# Altium project GPS track2.PrjPCB
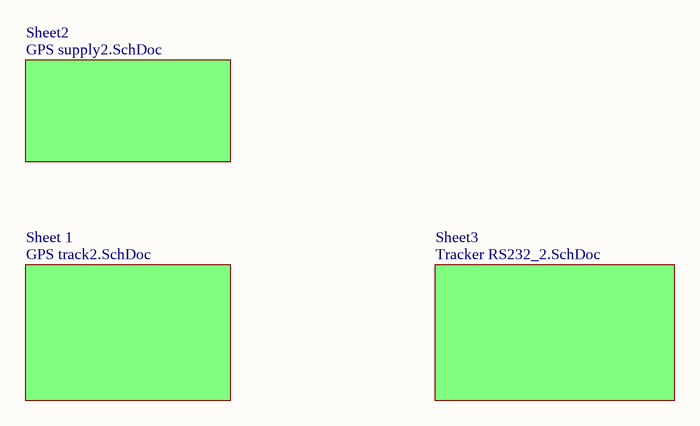
[diagram p0: Master track2.SchDoc]
4 sheets, 197 parts. Net scope: global (net labels, ports and power ports of the same name join across sheets).
Board file: GPS track2.PcbDoc
Sheets:
  Master track2.SchDoc
    Sheet2 = GPS supply2.SchDoc
    Sheet 1 = GPS track2.SchDoc
    Sheet3 = Tracker RS232_2.SchDoc

## Sheet Master track2.SchDoc: GPS tracker with AX.25 radio modem
size A4; Author: I.Ivanov; CompanyName: TU-Sofia; DrawnBy: Eng. I. Ivanov; Engineer: I.Ivanov; Organization: TU-Sofia; SheetNumber: 0; SheetTotal: 3

### Sub-sheets
Sheet2 = GPS supply2.SchDoc: no entries
Sheet3 = Tracker RS232_2.SchDoc: no entries
Sheet 1 = GPS track2.SchDoc: no entries

## Sheet GPS supply2.SchDoc: GPS traker power supply managment
size A4; DrawnBy: Eng. I.Ivanov; Engineer: Eng. I.Ivanov; Revision: 2; SheetNumber: 2; SheetTotal: 3; PageSetup: Record=PageOptions|CenterHorizontal=True|CenterVertical=True|PrintScale=4.01|XCorrection=1.00|YCorrection=1.00|PrintKind=0|BorderSize=5000000|LeftOffset=0|BottomOffset=0|Orientation=2|PaperLength=1000|PaperWidth=1000|Scale=100|PaperSource=15|PrintQuality=1200|MediaType=1|DitherType=10|PaperKind=A0|PrintScaleMode=1
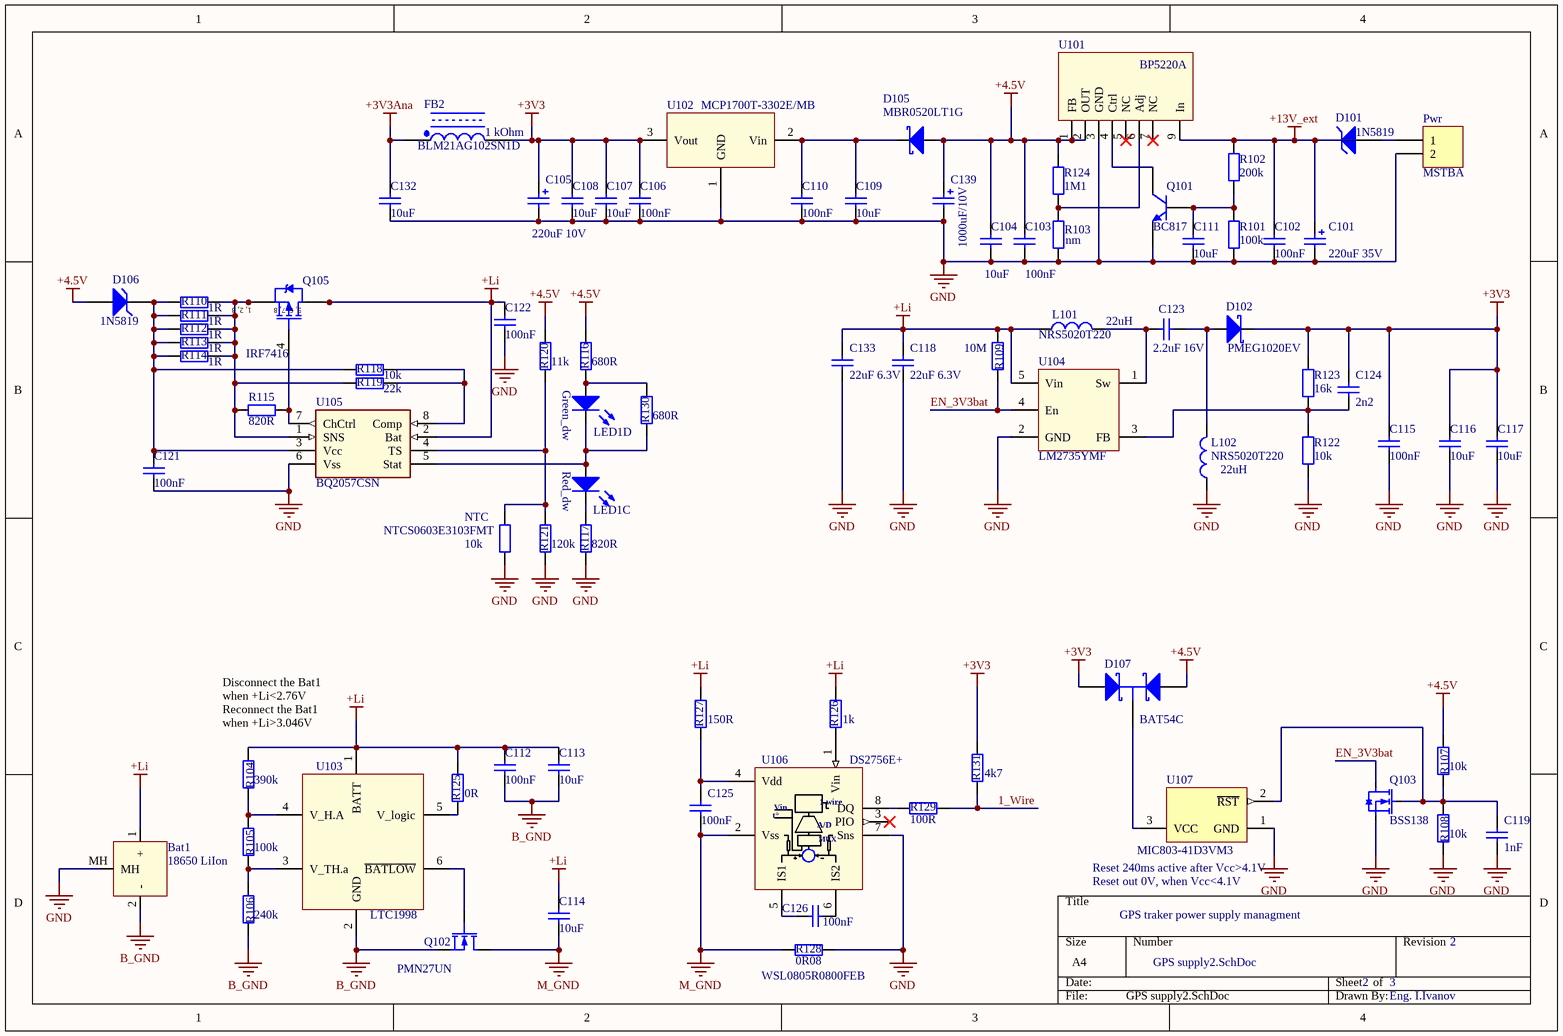
[diagram p1: GPS supply2.SchDoc]

### Parts
Bat1  value 18650 LiIon  [18650]  (hidden comment: LiIon)
C101  220uF 35V  [Cap electrolyt 7]
C102  value 100nF  [2012[0805]]  (hidden comment: Cap Semi)
C103  value 100nF  [2012[0805]]  (hidden comment: Cap Semi)
C104  value 10uF  [2012[0805]]  (hidden comment: Cap Semi)
C105  value 220uF 10V  [Cap electrolyt 8]  (hidden comment: CAP ELECTOLYT)
C106  value 100nF  [2012[0805]]  (hidden comment: Cap Semi)
C107  value 10uF  [2012[0805]]  (hidden comment: Cap Semi)
C108  value 10uF  [2012[0805]]  (hidden comment: Cap Semi)
C109  value 10uF  [2012[0805]]  (hidden comment: Cap Semi)
C110  value 100nF  [2012[0805]]  (hidden comment: Cap Semi)
C111  value 10uF  [2012[0805]]  (hidden comment: Cap Semi)
C112  value 100nF  [2012[0805]]  (hidden comment: Cap Semi)
C113  value 10uF  [2012[0805]]  (hidden comment: Cap Semi)
C114  value 10uF  [2012[0805]]  (hidden comment: Cap Semi)
C115  value 100nF  [2012[0805]]  (hidden comment: Cap Semi)
C116  value 10uF  [2012[0805]]  (hidden comment: Cap Semi)
C117  value 10uF  [2012[0805]]  (hidden comment: Cap Semi)
C118  value 22uF 6.3V  [2012[0805]]  (hidden comment: Cap Semi)
C119  value 1nF  [2012[0805]]  (hidden comment: Cap Semi)
C121  value 100nF  [2012[0805]]  (hidden comment: Cap Semi)
C122  value 100nF  [2012[0805]]  (hidden comment: Cap Semi)
C123  value 2.2uF 16V  [2012[0805]]  (hidden comment: Cap Semi)
C124  value 2n2  [2012[0805]]  (hidden comment: Cap Semi)
C125  value 100nF  [2012[0805]]  (hidden comment: Cap Semi)
C126  value 100nF  [2012[0805]]  (hidden comment: Cap Semi)
C132  value 10uF  [2012[0805]]  (hidden comment: Cap Semi)
C133  value 22uF 6.3V  [2012[0805]]  (hidden comment: Cap Semi)
C139  value 1000uF/10V  [Cap electrolyt 7]  (hidden comment: CAP ELECTOLYT)
D101  1N5819  [DO214]
D102  PMEG1020EV  [SOT-666-DIODE]
D105  MBR0520LT1G  [SOD-123]
D106  1N5819  [DO214]
D107  BAT54C  [SOT23_N]
FB2  BLM21AG102SN1D  value 1 kOhm  [RESC2012N]
L101  value NRS5020T220  Inductance: 22uH  [NRS5020Txxx]  (hidden comment: NRS5020T Taiyo-Yuden inductor)
L102  value NRS5020T220  Inductance: 22uH  [NRS5020Txxx]  (hidden comment: NRS5020T Taiyo-Yuden inductor)
LED1  4x LED's  [515-1061F_2x dual LED's]  (value not drawn)  (parts C,D of 4)
NTC  value 10k  [1608[0603]]  (hidden comment: Res2)
Pwr  MSTBA  [MSTBA2.5/2-G-5.08]
Q101  BC817  [SOT23_N]
Q102  value PMN27UN  [SOT-23-6-MOSFET]  (hidden comment: TrenchMOS™ ultra low level FET)
Q103  value BSS138  [SOT-23_my]  (hidden comment: My BSS138)
Q105  IRF7416  [SO-8_N]
R101  value 100k  [2012[0805]]  (hidden comment: Res2)
R102  value 200k  [2012[0805]]  (hidden comment: Res2)
R103  value nm  [2012[0805]]  (hidden comment: Res2)
R104  value 390k  [2012[0805]]  (hidden comment: Res2)
R105  value 100k  [2012[0805]]  (hidden comment: Res2)
R106  value 240k  [2012[0805]]  (hidden comment: Res2)
R107  value 10k  [2012[0805]]  (hidden comment: Res2)
R108  value 10k  [2012[0805]]  (hidden comment: Res2)
R109  value 10M  [2012[0805]]  (hidden comment: Res2)
R110  value 1R  [2012[0805]]  (hidden comment: Res2)
R111  value 1R  [2012[0805]]  (hidden comment: Res2)
R112  value 1R  [2012[0805]]  (hidden comment: Res2)
R113  value 1R  [2012[0805]]  (hidden comment: Res2)
R114  value 1R  [2012[0805]]  (hidden comment: Res2)
R115  value 820R  [2012[0805]]  (hidden comment: Res2)
R116  value 680R  [2012[0805]]  (hidden comment: Res2)
R117  value 820R  [2012[0805]]  (hidden comment: Res2)
R118  value 10k  [2012[0805]]  (hidden comment: Res2)
R119  value 22k  [2012[0805]]  (hidden comment: Res2)
R120  value 11k  [2012[0805]]  (hidden comment: Res2)
R121  value 120k  [2012[0805]]  (hidden comment: Res2)
R122  value 10k  [2012[0805]]  (hidden comment: Res2)
R123  value 16k  [2012[0805]]  (hidden comment: Res2)
R124  value 1M1  [2012[0805]]  (hidden comment: Res2)
R125  value 0R  [2012[0805]]  (hidden comment: Res2)
R126  value 1k  [2012[0805]]  (hidden comment: Res2)
R127  value 150R  [2012[0805]]  (hidden comment: Res2)
R128  WSL0805R0800FEB  value 0R08  [2012[0805]]
R129  value 100R  [2012[0805]]  (hidden comment: Res2)
R130  value 680R  [2012[0805]]  (hidden comment: Res2)
R131  value 4k7  [2012[0805]]  (hidden comment: Res2)
U101  value BP5220A  [BP502xA]  (hidden comment: Rohm switching DC/DC regulator)
U102  value MCP1700T-3302E/MB  [SOT89_my]  (hidden comment: MCP1700T-xxxx)
U103  value LTC1998  [SOT26A-6N]  (hidden comment: 2.5?A, 1% Accurate  SOT-23 Comparator and Voltage  Reference for Battery Monitoring)
U104  value LM2735YMF  [SOT23-5AN]  (hidden comment: 520kHz Space-Efficient Boost and SEPIC DC-DC  Regulator)
U105  BQ2057CSN  [SO8]
U106  value DS2756E+  [TSSOP 8_My]  (hidden comment: 1 wire fuel gauge)
U107  value MIC803-41D3VM3  [MF03A_N]  (hidden comment: LM809M3-4.00)

### Nets
+3V3: C105.1 C106.2 C107.2 C108.2 C115.2 C116.2 C117.2 C124.2 D102.2(K) D107.2(A2) FB2.2 R123.1 R131.2 U102.3(Vout)
+3V3Ana: C132.2 FB2.1
+4.5V: C103.2 C104.2 C139.1 D105.1(A) D106.1(A) D107.1(A1) R107.2 R116.2 R120.1 R124.1 U101.1(FB) U101.2(OUT)
+13V_ext: C101.1 C102.2 D101.2(K) R102.2 U101.9(In)
+Li: Bat1.1(+) C112.2 C113.2 C114.2 C118.2 C122.2 C133.2 L101.1 Q105.5(D) Q105.6(D) Q105.7(D) Q105.8(D) R104.2 R109.2 R125.1 R126.1 R127.1 U103.1(BATT) U104.5(Vin) U105.2(Bat)
B_GND: Bat1.2(-) C112.1 C113.1 Q102.3(S) R106.1 U103.2(GND)
GND: Bat1.MH C101.2 C102.1 C103.1 C104.1 C105.2 C106.1 C107.1 C108.1 C109.1 C110.1 C111.1 C115.1 C116.1 C117.1 C118.1 C119.1 C121.1 C122.1 C132.1 C133.1 C139.2 L102.1 NTC.2 Pwr.2 Q101.2(E) Q103.2(S) R101.1 R103.1 R108.1 R117.1 R121.2 R122.2 R128.2 U101.3(GND) U102.1(GND) U104.2(GND) U105.6(Vss) U106.7(Sns) U107.1(GND)
M_GND: C114.1 C125.1 Q102.1(D) R128.1 U106.2(Vss)
1_Wire: R129.2 R131.1
EN_3V3bat: Q103.3(D) R109.1 U104.4(En)
NetC109_2: C109.2 C110.2 D105.2(K) U102.2(Vin)
NetC111_2: C111.2 Q101.1(B) R101.2 R102.1
NetC119_2: C119.2 Q103.1(G) R107.1 R108.2 U107.2(~{RST})
NetC121_2: C121.2 D106.2(K) R110.2 R111.2 R112.2 R113.2 R114.2 R118.2 U105.3(Vcc)
NetC123_1: C123.1 D102.1(A) L102.2
NetC123_2: C123.2 L101.2 U104.1(Sw)
NetC124_1: C124.1 R122.1 R123.2 U104.3(FB)
NetC125_2: C125.2 R127.2 U106.4(Vdd)
NetC126_1: C126.1 U106.6(IS2)
NetC126_2: C126.2 U106.5(IS1)
NetD101_1: D101.1(A) Pwr.1
NetD107_3: D107.3(K) U107.3(VCC)
NetLED1_1d: LED1.1d(K) R117.2
NetLED1_2d: LED1.2d(A) LED1.3d(K) R130.1 U105.5(Stat)
NetLED1_4d: LED1.4d(A) R116.1 R130.2
NetNTC_1: NTC.1 R120.2 R121.1 U105.4(TS)
NetQ101_3: Q101.3(C) U101.4(Ctrl)
NetQ102_2: Q102.2(G) U103.6(~{BATLOW})
NetQ105_1: Q105.1(S) Q105.2(S) Q105.3(S) R110.1 R111.1 R112.1 R113.1 R114.1 R115.1 R119.2 U105.1(SNS)
NetQ105_4: Q105.4(G) R115.2 U105.7(ChCtrl)
NetR103_2: R103.2 R124.2 U101.6(Adj)
NetR104_1: R104.1 R105.2 U103.4(V_H.A)
NetR105_1: R105.1 R106.2 U103.3(V_TH.a)
NetR118_1: R118.1 R119.1 U105.8(Comp)
NetR125_2: R125.2 U103.5(V_logic)
NetR126_2: R126.2 U106.1(Vin)
NetR129_1: R129.1 U106.8(DQ)

Not connected (* = marked no-connect by the designer): U101 5(NC)* 7(NC)*; U106 3(PIO)*

### Notes on the sheet
- (near NTC) NTCS0603E3103FMT
- Disconnect the Bat1 when +Li<2.76V
  Reconnect the Bat1 when +Li>3.046V
- (near U107) Reset 240ms active after Vcc>4.1V
- (near U107) Reset out 0V, when Vcc<4.1V
- (in symbol 515-1061F_2x dual LED's, part C) Red_dw
- (in symbol 515-1061F_2x dual LED's, part D) Green_dw
- (in symbol DS2756+) 1 wire; t°; A/D; MUX
- (in symbol IRF7416) 1, 2, 3; 5, 6, 7, 8

### Library data of the parts
Bat1 = LiIon: 18650 cell; created: charge
C101 C105 C139 = CAP ELECTOLYT: Polarized Capacitor (TH); Published: 8-Jun-2000; Revision: July-2002: Re-released for DXP Platform.; Publisher: Altium Limited
  C101: Value: 220uF 35V
C102-C104 C106-C119 C121-C126 C132 C133 = Cap Semi: Capacitor (Semiconductor SIM Model); Published: 8-Jun-2000; LatestRevisionDate: 17-Jul-2002; LatestRevisionNote: Re-released for DXP Platform.; PackageReference: C1206; Publisher: Altium Limited
D101 D106 = BZG05C4V7: Silicon Zener Diode (3W); Published: 8-Jun-2000; LatestRevisionDate: 17-Jul-2002; LatestRevisionNote: Re-released for DXP Platform.; DatasheetDocument: 1-Apr-1999; PackageDocument: Apr-1999; PackageReference: DO214; Publisher: Altium Limited; ComponentLink1Description: Manufacturer Link; ComponentLink1URL: http://www.vishay.com/; ComponentLink2Description: Datasheet; ComponentLink2URL: http://www.vishay.com/docs/85595/85595.pdf
D102 = PMEG1020EV: Ultra low VF MEGA Schottky barrier  rectifier; Order Code: 8737835; Details: 10V, 2A, Uf=0.28V @ 1A; Supplier: Farnell; Price: ˆ0.119; Value: PMEG1020EV
D105 = MBR0520LT1G: Surface Mount  Schottky Power Rectifier; Manufacturer: On Semiconductor; Description: DIODE, SCHOTTKY, 0.5A, 20V, 0.38V@0.5A; Created by: Charge; Supplier: Farnell; Supplier Order code: 9556915; Supplier Price: ˆ0.22; Value: MBR0520LT1G
D107 = BAT54C: Schottky Barrier Double Diode; Published: 17-Sep-2003; LatestRevisionDate: 12-Dec-2006; LatestRevisionNote: IPC-7351 Footprint Added.; DatasheetVersion: 4-Mar-2002; PackageVersion: May-1999; PackageReference: SOT23; Publisher: Altium Limited; PackageDescription: 3-Pin SOT-23 Package 0.95 mm Pitch, 2.3 mm Lead Span; ComponentLink1Description: Manufacturer Link; ComponentLink1URL: http://www.semiconductors.philips.com/; ComponentLink2Description: Datasheet; ComponentLink2URL: http://www.semiconductors.philips.com/acrobat/datasheets/BAT54_SERIES_4.pdf
FB2 = Inductor Isolated: Isolated Inductor; PackageDocument: 1988; Published: 24-Mar-1999; LatestRevisionDate: 17-Jul-2002; LatestRevisionNote: Re-released for DXP Platform.; PackageReference: 425; Publisher: Altium Limited
LED1 = 515-1061F_2x dual LED's: Light pipe manufacturer: Dialight; LED's type: 3x2.5mm leadless, dual, 4 pins; Example LED's 1: SML020 (Rohm); Example LED's 1: 597-77x1-5xx (Dialight); Light pipe: 515-1061F
NTC R101-R131 = Res2: Resistor; Published: 8-Jun-2000; LatestRevisionDate: 17-Jul-2002; LatestRevisionNote: Re-released for DXP Platform.; PackageReference: AXIAL-0.4; Publisher: Altium Limited
Pwr = TS-501 2P: Header, 2-Pin; Revision: 17-Jul-2002: Re-released for DXP Platform.; Publisher: Altium Limited
Q101 = BC817: NPN General-purpose Transistor; Published: 17-Sep-2003; LatestRevisionDate: 12-Dec-2006; LatestRevisionNote: IPC-7351 Footprint Added.; DatasheetVersion: Jun-1999; PackageVersion: May-1999; PackageReference: SOT23; Publisher: Altium Limited; PackageDescription: 3-Pin SOT-23 Package 0.95 mm Pitch, 2.3 mm Lead Span; ComponentLink1Description: Manufacturer Link; ComponentLink1URL: http://www.semiconductors.philips.com/; ComponentLink2Description: Datasheet; ComponentLink2URL: http://www.semiconductors.philips.com/acrobat/datasheets/BC817_BC817W_BC337_5.pdf
Q102 = PMN27UN: TrenchMOS™ ultra low level FET SOT-457; Description: NMOSFET 20V, 5A, Ugs_th=0.7V, Rds=40mOhms; Order Code: 1758104; Supplier: Farnell; Price: ˆ0.156
Q103 = BSS138_my
Q105 = IRF7416: HEXFET Power MOSFET; Published: 8-Jun-2000; LatestRevisionDate: 13-Apr-2006; LatestRevisionNote: IPC-7351 Footprint Added.; DatasheetVersion: Aug-1997; PackageVersion: Feb-2001; PackageReference: SO-8; Publisher: Altium Limited; PackageDescription: 8-Pin Plastic Small Outline Integrated Circuit 1.27 mm Pitch; Code_JEDEC: MS-012-AA; Code_IPC: SOIC127P600-8; ComponentLink1Description: Manufacturer Link; ComponentLink1URL: http://www.irf.com/; ComponentLink2Description: Datasheet; ComponentLink2URL: http://www.irf.com/product-info/datasheets/data/irf7416.pdf; Value: IRF7416
U101 = BP502x_Rohm: BP5220A: 8-38V input 5V 1A out; Order code: BP5020A(BP5220) ROHM; created: charge; Description: Rohm switching DC/DC regulator; Supplier: Comet; Price: 12.75 BGN
U103 = LTC1998: description: 2.5uA, 1% Accurate  SOT-23 Comparator and Voltage  Reference for Battery Monitoring; Order Code: 1663873; Supplier: Farnell; Price: ˆ2.90
U104 = LM2735YMF: Details: 520kHz/1.6MHz – Space-Efficient Boost and SEPIC DC-DC  Regulator
U105 = BQ2057CSN: Advanced charge controller IC; Supplier: Farnell/Comet; Value: BQ2057CSN
U106 = DS2756+: high-precision battery fuel gauge; Manufacturer: Dallas/Maxim Integrated; Order Code: 1455594; Supplier: Farnell; Price: 6.21 ˆ
U107 = LM809M3-4.00: 3-Pin Microprocessor Reset Circuit, 4.00V Threshold; Manufacturer: National Semiconductor; CompType: MiscPower; PackageTopMarking: S6B*XTT; PowerWise: N; FirstPublished: 4-Dec-2008; DatasheetVersion: Sep-2002; PackageVersion: revB, Mar-2003; PackageReference: MF03A; Publisher: Altium Limited; PackageDescription: Molded SOT-23, .115 x .051 x .037in Body, 3 Lead, .075 in Pitch; PartNumber: LM809M3-4.00; RoHS: Y; PinCount: 3; DigiKeyPartNumber: LM809M3-4.00CT-ND; ComponentLink1Description: LM809 Datasheet; ComponentLink1URL: http://www.national.com/ds/LM/LM809.pdf; ComponentLink2Description: LM809 Web Page; ComponentLink2URL: http://www.national.com/mpf/LM/LM809.html; ComponentLink3Description: MF03A Package Page; ComponentLink3URL: http://www.national.com/packaging/folders/mf03a.html
L101 L102 = NRS5020T Taiyo-Yuden inductor: Footprint: 4.9x4.9x2.0mm

## Sheet GPS track2.SchDoc: GPS Tracker APRS based
size A3; CheckedBy: I.Ivanov; Author: I.Ivanov; DrawnBy: Eng. I.Ivanov; Engineer: Eng. I.Ivanov; Organization: TU-Sofia; Revision: 2; SheetNumber: 1; SheetTotal: 3; PageSetup: Record=PageOptions|CenterHorizontal=True|CenterVertical=True|PrintScale=1.04|XCorrection=1.00|YCorrection=1.00|PrintKind=2|BorderSize=5000000|LeftOffset=0|BottomOffset=0|Orientation=2|PaperLength=1000|PaperWidth=1000|Scale=100|PaperSource=15|PrintQuality=3600|MediaType=1|DitherType=10|PaperKind=A3|PrintScaleMode=1; ProjectName: GPS Tracker
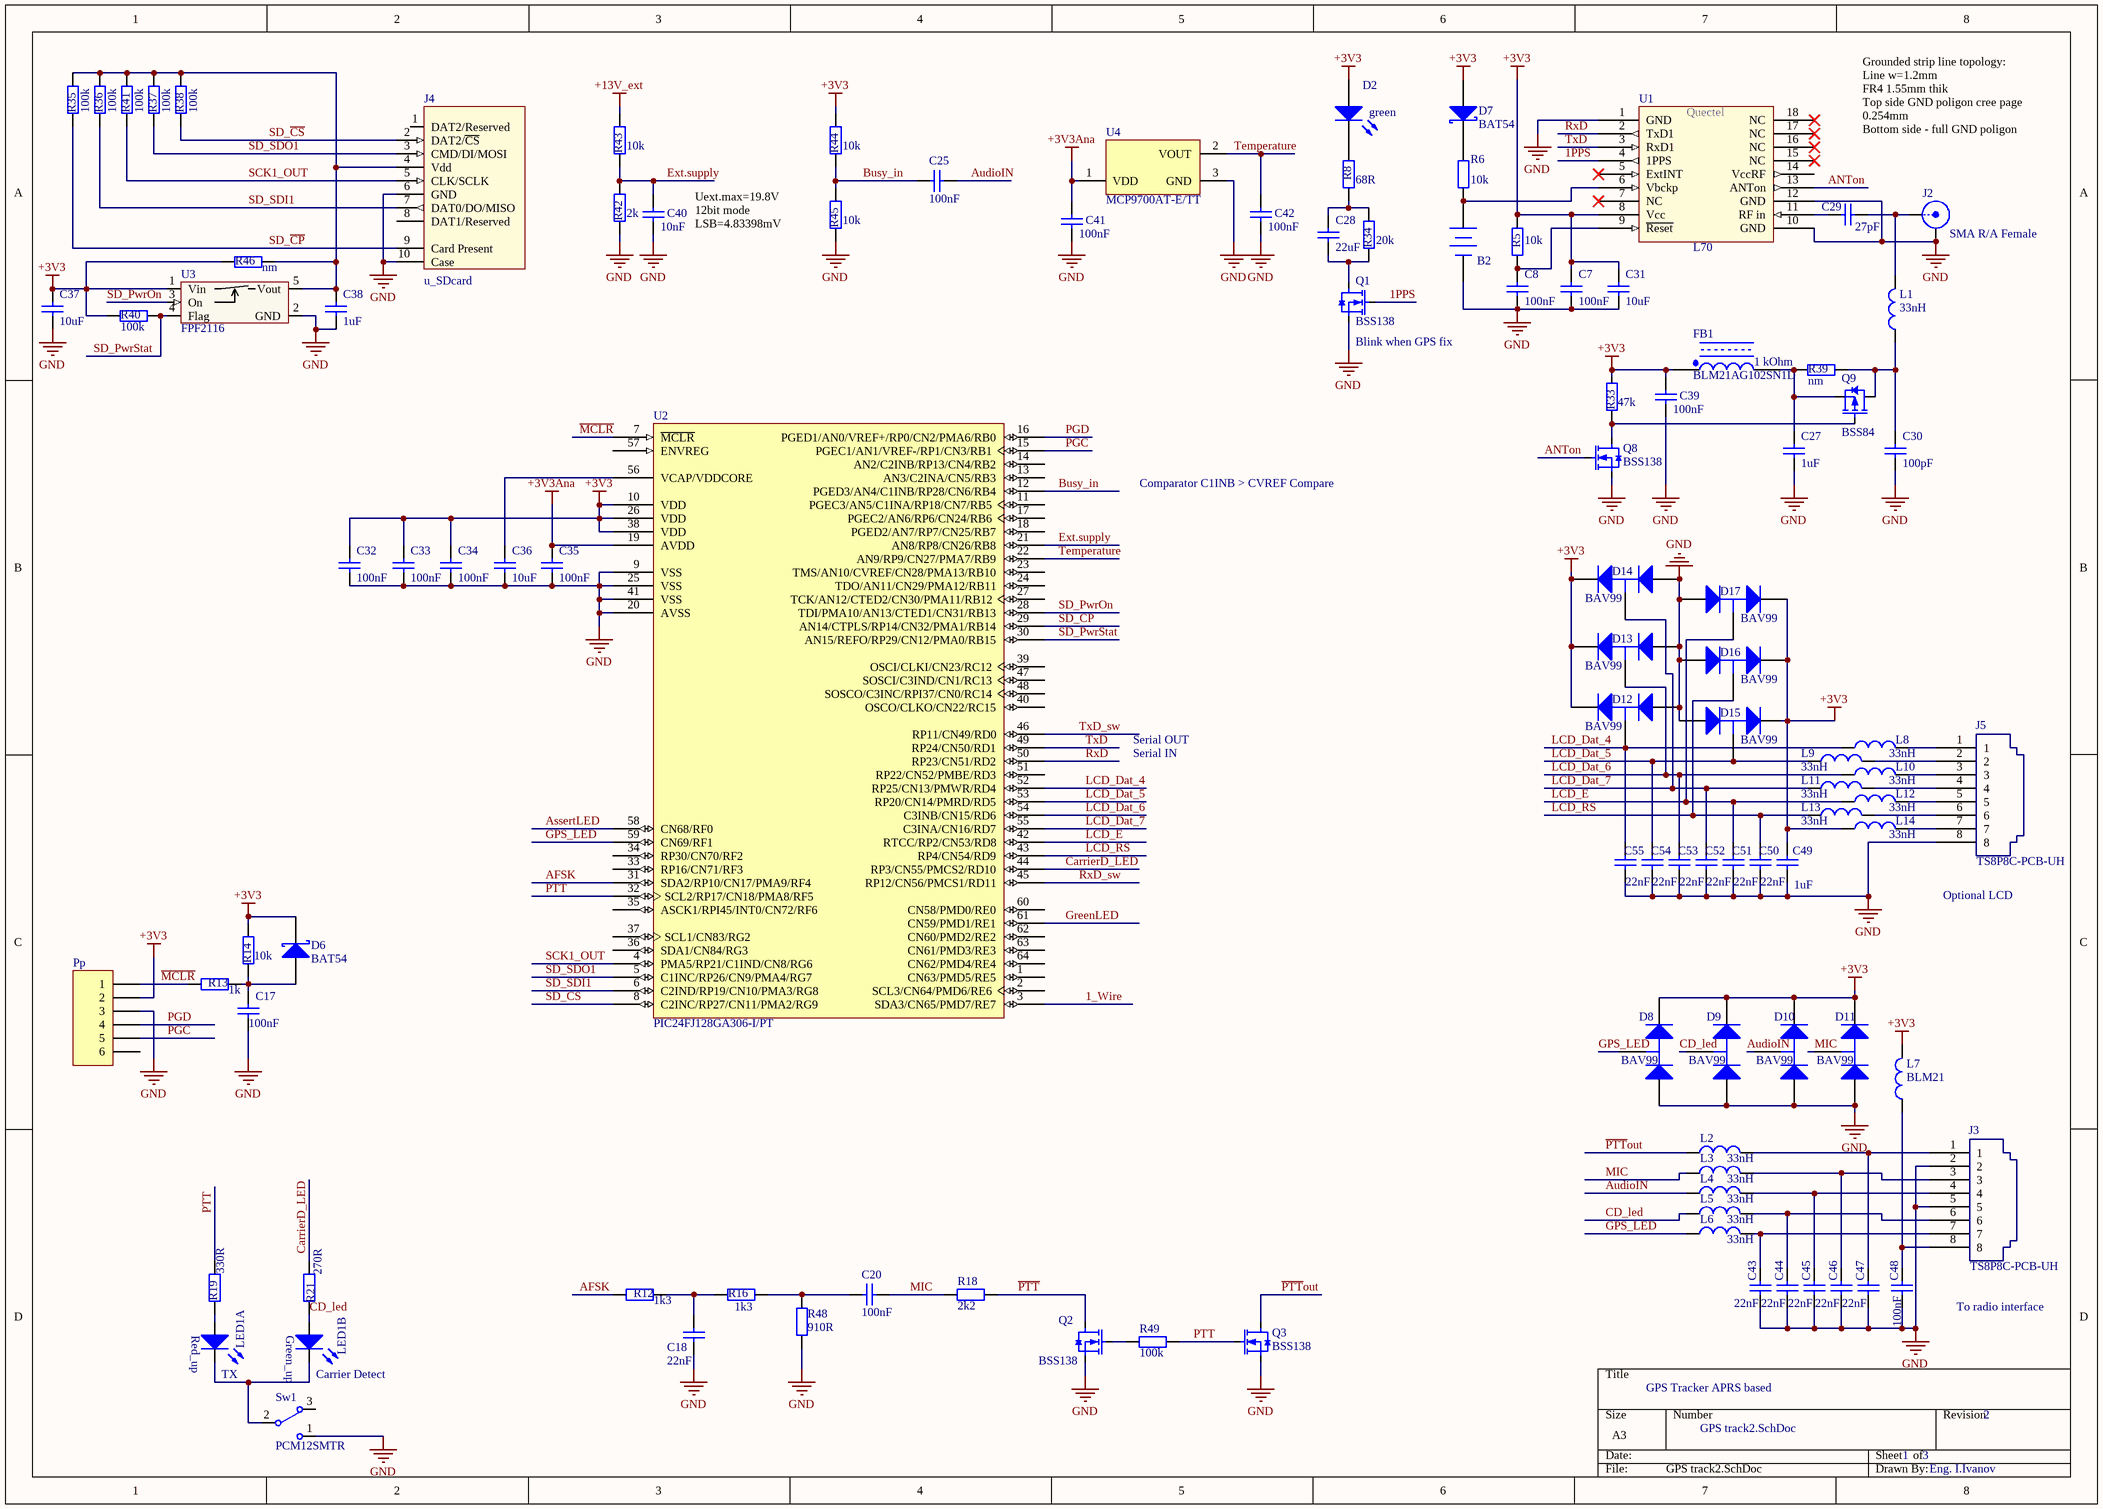
[diagram p2: GPS track2.SchDoc]

### Parts
B2  CR2032 holder  [1065 Keystone]  (value not drawn)
C7  value 100nF  [2012[0805]]  (hidden comment: Cap Semi)
C8  value 100nF  [2012[0805]]  (hidden comment: Cap Semi)
C17  value 100nF  [2012[0805]]  (hidden comment: Cap Semi)
C18  value 22nF  [2012[0805]]  (hidden comment: Cap Semi)
C20  value 100nF  [2012[0805]]  (hidden comment: Cap Semi)
C25  value 100nF  [C0805]  (hidden comment: Cap Semi)
C27  value 1uF  [C0805]  (hidden comment: Cap Semi)
C28  value 22uF  [C0805]  (hidden comment: Cap Semi)
C29  value 27pF  [C0805]  (hidden comment: Cap Semi)
C30  value 100pF  [C0805]  (hidden comment: Cap Semi)
C31  value 10uF  [C0805]  (hidden comment: Cap Semi)
C32  value 100nF  [2012[0805]]  (hidden comment: Cap Semi)
C33  value 100nF  [2012[0805]]  (hidden comment: Cap Semi)
C34  value 100nF  [2012[0805]]  (hidden comment: Cap Semi)
C35  value 100nF  [2012[0805]]
C36  value 10uF  [2012[0805]]  (hidden comment: Cap Semi)
C37  value 10uF  [2012[0805]]  (hidden comment: Cap Semi)
C38  value 1uF  [2012[0805]]  (hidden comment: Cap Semi)
C39  value 100nF  [C0805]  (hidden comment: Cap Semi)
C40  value 10nF  [C0805]  (hidden comment: Cap Semi)
C41  value 100nF  [C0805]  (hidden comment: Cap Semi)
C42  value 100nF  [C0805]  (hidden comment: Cap Semi)
C43  value 22nF  [C0805]  (hidden comment: Cap Semi)
C44  value 22nF  [C0805]  (hidden comment: Cap Semi)
C45  value 22nF  [C0805]  (hidden comment: Cap Semi)
C46  value 22nF  [C0805]  (hidden comment: Cap Semi)
C47  value 22nF  [C0805]  (hidden comment: Cap Semi)
C48  value 100nF  [C0805]  (hidden comment: Cap Semi)
C49  value 1uF  [C0805]  (hidden comment: Cap Semi)
C50  value 22nF  [C0805]  (hidden comment: Cap Semi)
C51  value 22nF  [C0805]  (hidden comment: Cap Semi)
C52  value 22nF  [C0805]  (hidden comment: Cap Semi)
C53  value 22nF  [C0805]  (hidden comment: Cap Semi)
C54  value 22nF  [C0805]  (hidden comment: Cap Semi)
C55  value 22nF  [C0805]  (hidden comment: Cap Semi)
D2  OSTG1206C1A  [3.2X1.6X1.1]  (value not drawn)
D6  BAT54  [SOT23_N]
D7  BAT54  [SOT23_N]
D8  BAV99  [SOT-23]
D9  BAV99  [SOT-23]
D10  BAV99  [SOT-23]
D11  BAV99  [SOT-23]
D12  BAV99  [SOT-23]
D13  BAV99  [SOT-23]
D14  BAV99  [SOT-23]
D15  BAV99  [SOT-23]
D16  BAV99  [SOT-23]
D17  BAV99  [SOT-23]
FB1  BLM21AG102SN1D  value 1 kOhm  [RESC2012N]
J2  value SMA R/A Female  [SMA R/A PCB]  (hidden comment: SMA R/A PCB)
J3  TS8P8C-PCB-UH  [TS8P8C-PCB-UH]
J4  value u_SDcard  [112A-TAAR-R02]  (hidden comment: microSD Socket)
J5  TS8P8C-PCB-UH  [TS8P8C-PCB-UH]
L1  value 33nH  [CCFH0805 C Series]  (hidden comment: CCFH 0805 series choke)
L2  value 33nH  [CCFH0805 C Series]  (hidden comment: CCFH 0805 series choke)
L3  value 33nH  [CCFH0805 C Series]  (hidden comment: CCFH 0805 series choke)
L4  value 33nH  [CCFH0805 C Series]  (hidden comment: CCFH 0805 series choke)
L5  value 33nH  [CCFH0805 C Series]  (hidden comment: CCFH 0805 series choke)
L6  value 33nH  [CCFH0805 C Series]  (hidden comment: CCFH 0805 series choke)
L7  value BLM21  [CCFH0805 C Series]  (hidden comment: CCFH 0805 series choke)
L8  value 33nH  [CCFH0805 C Series]  (hidden comment: CCFH 0805 series choke)
L9  value 33nH  [CCFH0805 C Series]  (hidden comment: CCFH 0805 series choke)
L10  value 33nH  [CCFH0805 C Series]  (hidden comment: CCFH 0805 series choke)
L11  value 33nH  [CCFH0805 C Series]  (hidden comment: CCFH 0805 series choke)
L12  value 33nH  [CCFH0805 C Series]  (hidden comment: CCFH 0805 series choke)
L13  value 33nH  [CCFH0805 C Series]  (hidden comment: CCFH 0805 series choke)
L14  value 33nH  [CCFH0805 C Series]  (hidden comment: CCFH 0805 series choke)
LED1  4x LED's  [515-1061F_2x dual LED's]  (value not drawn)  (parts A,B of 4)
Pp  Header 6  [HDR1X6]  (value not drawn)
Q1  value BSS138  [SOT-23_my]  (hidden comment: My BSS138)
Q2  value BSS138  [SOT-23_my]  (hidden comment: My BSS138)
Q3  value BSS138  [SOT-23_my]  (hidden comment: My BSS138)
Q8  value BSS138  [SOT-23_my]  (hidden comment: My BSS138)
Q9  value BSS84  [SOT-23_my]  (hidden comment: My SOT23 BSS84)
R5  value 10k  [2012[0805]]  (hidden comment: Res2)
R6  value 10k  [2012[0805]]  (hidden comment: Res2)
R8  value 68R  [2012[0805]]  (hidden comment: Res2)
R12  value 1k3  [RESC2012N]  (hidden comment: Res2)
R13  value 1k  [RESC2012N]  (hidden comment: Res2)
R14  value 10k  [2012[0805]]  (hidden comment: Res2)
R16  value 1k3  [RESC2012N]  (hidden comment: Res2)
R18  value 2k2  [2012[0805]]  (hidden comment: Res2)
R19  value 330R  [2012[0805]]  (hidden comment: Res2)
R21  value 270R  [2012[0805]]  (hidden comment: Res2)
R33  value 47k  [2012[0805]]  (hidden comment: Res2)
R34  value 20k  [2012[0805]]  (hidden comment: Res2)
R35  value 100k  [2012[0805]]  (hidden comment: Res2)
R36  value 100k  [2012[0805]]  (hidden comment: Res2)
R37  value 100k  [2012[0805]]  (hidden comment: Res2)
R38  value 100k  [2012[0805]]  (hidden comment: Res2)
R39  value nm  [2012[0805]]  (hidden comment: Res2)
R40  value 100k  [2012[0805]]  (hidden comment: Res2)
R41  value 100k  [2012[0805]]  (hidden comment: Res2)
R42  value 2k  [2012[0805]]  (hidden comment: Res2)
R43  value 10k  [2012[0805]]  (hidden comment: Res2)
R44  value 10k  [2012[0805]]  (hidden comment: Res2)
R45  value 10k  [2012[0805]]  (hidden comment: Res2)
R46  value nm  [2012[0805]]  (hidden comment: Res2)
R48  value 910R  [2012[0805]]  (hidden comment: Res2)
R49  value 100k  [2012[0805]]  (hidden comment: Res2)
Sw1  value PCM12SMTR  [PCM12SMTR]  (hidden comment: SPDT)
U1  value L70  Manufacturer: Quectel  [L70]  (hidden comment: L70 Quectel)
U2  PIC24FJ128GA306-I/PT  [TQFP-PT64_N]
U3  value FPF2116  [SOT23-5AN]  (hidden comment: IntelliMAX™ Advanced Load Management)
U4  MCP9700AT-E/TT  [SOT-23-TT3_N]

### Nets
+3V3: C7.2 C31.1 C32.2 C33.2 C34.2 C37.2 C39.1 C49.1 D2.1(A) D6.3(K) D7.1(A) D8.2(K) D9.2(K) D10.2(K) D11.2(K) D12.2(K) D13.2(K) D14.2(K) D15.2(K) D16.2(K) D17.2(K) FB1.1 L7.2 L14.1 Pp.2 R5.2 R14.1 R33.1 R40.1 R44.1 R46.1 U1.8(Vcc) U2.10(VDD) U2.26(VDD) U2.38(VDD) U3.1(Vin)
+3V3Ana: C35.2 C41.1 U2.19(AVDD) U4.1(VDD)
+13V_ext: R43.1
GND: B2.2(-) C7.1 C8.1 C17.1 C18.1 C27.1 C30.2 C31.2 C32.1 C33.1 C34.1 C35.1 C36.1 C37.1 C38.1 C39.2 C40.2 C41.2 C42.2 C43.2 C44.2 C45.2 C46.2 C47.2 C48.2 C49.2 C50.2 C51.2 C52.2 C53.2 C54.2 C55.2 D8.1(A) D9.1(A) D10.1(A) D11.1(A) D12.1(A) D13.1(A) D14.1(A) D15.1(A) D16.1(A) D17.1(A) J2.2(Y) J3.2 J3.5 J4.6(GND) J4.10(Case) J5.8 Pp.3 Q1.2(S) Q2.2(S) Q3.2(S) Q8.2(S) R42.2 R45.2 R48.1 Sw1.1 U1.1(GND) U1.10(GND) U1.12(GND) U2.9(VSS) U2.20(AVSS) U2.25(VSS) U2.41(VSS) U3.2(GND) U4.3(GND)
1_Wire: U2.3(SDA3/CN65/PMD7/RE7)
1PPS: Q1.1(G) U1.4(1PPS)
AFSK: R12.2 U2.31(SDA2/RP10/CN17/PMA9/RF4)
ANTon: Q8.1(G) U1.13(ANTon)
AssertLED: U2.58(CN68/RF0)
AudioIN: C25.2 D10.3(C) L4.1
Busy_in: C25.1 R44.2 R45.1 U2.12(PGED3/AN4/C1INB/RP28/CN6/RB4)
CarrierD_LED: R21.1 U2.44(RP3/CN55/PMCS2/RD10)
CD_led: D9.3(C) L5.1 LED1.4u(A) R21.2
Ext.supply: C40.1 R42.1 R43.2 U2.21(AN8/RP8/CN26/RB8)
GPS_LED: D8.3(C) L6.1 U2.59(CN69/RF1)
GreenLED: U2.61(CN59/PMD1/RE1)
LCD_Dat_4: C55.1 D12.3(C) L8.1 U2.52(RP25/CN13/PMWR/RD4)
LCD_Dat_5: C54.1 D15.3(C) L9.1 U2.53(RP20/CN14/PMRD/RD5)
LCD_Dat_6: C53.1 D13.3(C) L10.1 U2.54(C3INB/CN15/RD6)
LCD_Dat_7: C52.1 D14.3(C) L11.1 U2.55(C3INA/CN16/RD7)
LCD_E: C51.1 D17.3(C) L12.1 U2.42(RTCC/RP2/CN53/RD8)
LCD_RS: C50.1 D16.3(C) L13.1 U2.43(RP4/CN54/RD9)
~{MCLR}: Pp.1 R13.2 U2.7(~{MCLR})
MIC: C20.1 D11.3(C) L3.1 R18.2
~{PTT}: Q2.3(D) R18.1
~{PTT}out: L2.1 Q3.3(D)
PGC: Pp.5 U2.15(PGEC1/AN1/VREF-/RP1/CN3/RB1)
PGD: Pp.4 U2.16(PGED1/AN0/VREF+/RP0/CN2/PMA6/RB0)
PTT: Q3.1(G) R19.1 R49.2 U2.32(SCL2/RP17/CN18/PMA8/RF5)
RxD: U1.2(TxD1) U2.50(RP23/CN51/RD2)
RxD_sw: U2.45(RP12/CN56/PMCS1/RD11)
SCK1_OUT: J4.5(CLK/SCLK) R41.1 U2.4(PMA5/RP21/C1IND/CN8/RG6)
SD_~{CP}: J4.9(Card_Present) R35.2 U2.29(AN14/CTPLS/RP14/CN32/PMA1/RB14)
SD_~{CS}: J4.2(DAT2/~{CS}) R38.2 U2.8(C2INC/RP27/CN11/PMA2/RG9)
SD_PwrOn: U2.28(TDI/PMA10/AN13/CTED1/CN31/RB13) U3.3(On)
SD_PwrStat: R40.2 U2.30(AN15/REFO/RP29/CN12/PMA0/RB15) U3.4(Flag)
SD_SDI1: J4.7(DAT0/DO/MISO) R36.2 U2.6(C2IND/RP19/CN10/PMA3/RG8)
SD_SDO1: J4.3(CMD/DI/MOSI) R37.2 U2.5(C1INC/RP26/CN9/PMA4/RG7)
Temperature: C42.1 U2.22(AN9/RP9/CN27/PMA7/RB9) U4.2(VOUT)
TxD: U1.3(RxD1) U2.49(RP24/CN50/RD1)
TxD_sw: U2.46(RP11/CN49/RD0)
NetB2_1: B2.1(+) R6.1 U1.6(Vbckp)
NetC8_2: C8.2 R5.1 U1.9(~{Reset})
NetC17_2: C17.2 D6.1(A) R13.1 R14.2
NetC18_2: C18.2 R12.1 R16.2
NetC20_2: C20.2 R16.1 R48.2
NetC27_2: C27.2 FB1.2 Q9.2(S) R39.1
NetC28_1: C28.1 Q1.3(D) R34.2
NetC28_2: C28.2 R8.1 R34.1
NetC29_1: C29.1 J2.1(X) L1.2
NetC29_2: C29.2 U1.11(RF_in)
NetC30_1: C30.1 L1.1 Q9.3(D) R39.2
NetC36_2: C36.2 U2.56(VCAP/VDDCORE)
NetC38_2: C38.2 J4.4(Vdd) R35.1 R36.1 R37.1 R38.1 R41.2 R46.2 U3.5(Vout)
NetC43_1: C43.1 J3.7 L6.2
NetC44_1: C44.1 J3.6 L5.2
NetC45_1: C45.1 J3.4 L4.2
NetC46_1: C46.1 J3.3 L3.2
NetC47_1: C47.1 J3.1 L2.2
NetC48_1: C48.1 J3.8 L7.1
NetD2_2: D2.2(K) R8.2
NetD7_3: D7.3(K) R6.2
NetJ5_1: J5.1 L8.2
NetJ5_2: J5.2 L9.2
NetJ5_3: J5.3 L10.2
NetJ5_4: J5.4 L11.2
NetJ5_5: J5.5 L12.2
NetJ5_6: J5.6 L13.2
NetJ5_7: J5.7 L14.2
NetLED1_1u: LED1.1u(K) LED1.3u(K) Sw1.2
NetLED1_2u: LED1.2u(A) R19.2
NetQ2_1: Q2.1(G) R49.1
NetQ8_3: Q8.3(D) Q9.1(G) R33.2

Not connected (* = marked no-connect by the designer): J4 1(DAT2/Reserved) 8(DAT1/Reserved); Pp 6; Sw1 3; U1 5(ExtINT)* 7(NC)* 14(VccRF) 15(NC)* 16(NC)* 17(NC)* 18(NC)*; U2 1(CN63/PMD5/RE5) 2(SCL3/CN64/PMD6/RE6) 11(PGEC3/AN5/C1INA/RP18/CN7/RB5) 13(AN3/C2INA/CN5/RB3) 14(AN2/C2INB/RP13/CN4/RB2) 17(PGEC2/AN6/RP6/CN24/RB6) 18(PGED2/AN7/RP7/CN25/RB7) 23(TMS/AN10/CVREF/CN28/PMA13/RB10) 24(TDO/AN11/CN29/PMA12/RB11) 27(TCK/AN12/CTED2/CN30/PMA11/RB12) 33(RP16/CN71/RF3) 34(RP30/CN70/RF2) 35(ASCK1/RPI45/INT0/CN72/RF6) 36(SDA1/CN84/RG3) 37(SCL1/CN83/RG2) 39(OSCI/CLKI/CN23/RC12) 40(OSCO/CLKO/CN22/RC15) 47(SOSCI/C3IND/CN1/RC13) 48(SOSCO/C3INC/RPI37/CN0/RC14) 51(RP22/CN52/PMBE/RD3) 57(ENVREG) 60(CN58/PMD0/RE0) 62(CN60/PMD2/RE2) 63(CN61/PMD3/RE3) 64(CN62/PMD4/RE4)

### Notes on the sheet
- (near D2) green
- Grounded strip line topology:
  Line w=1.2mm
  FR4 1.55mm thik
  Top side GND poligon cree page 0.254mm
  Bottom side - full GND poligon
- Uext.max=19.8V
  12bit mode
  LSB=4.83398mV
- (near Q1) Blink when GPS fix
- Comparator C1INB > CVREF Compare
- Serial IN
- Serial OUT
- (near J5) Optional LCD
- To radio interface
- (near LED1) TX
- Carrier Detect
- (in symbol 515-1061F_2x dual LED's, part A) Red_up
- (in symbol 515-1061F_2x dual LED's, part B) Green_up

### Library data of the parts
B2 = CR2032_holder: Value: Keystone 103; Details: CR2032 battery holder TH; Option: 103 - horizontal; 1065 vertical; Created by: Charge; Value 2: Keystone 1065
C7 C17 C18 C20 C25 C27-C55 = Cap Semi: Capacitor (Semiconductor SIM Model); Published: 8-Jun-2000; LatestRevisionDate: 17-Jul-2002; LatestRevisionNote: Re-released for DXP Platform.; Publisher: Altium Limited
  C7 C17 C18 C20 C25 C27-C40 C42-C55: PackageReference: C1206
D2 = HSMM-C150: High Performance SMT Chip LED, Green; LuminousIntensity: 40mcd (Minimum).; PCB_Layout: Complies with manufacturer's recommendation.; Published: 11-Dec-2002; DatasheetDocument: 11-Mar-2002; PackageDocument: 26-Feb-2002; PackageReference: 3.2X1.6X1.1; Publisher: Altium Limited; LED_Colour: Green; ComponentLink1Description: Manufacturer Link; ComponentLink1URL: http://www.agilent.com/; ComponentLink2Description: Datasheet; ComponentLink2URL: http://cp.literature.agilent.com/litweb/pdf/5988-5213EN.pdf
D6 D7 = BAT54: Schottky Barrier Diode; Note: Pin 2 is not connected and is not drawn; Published: 17-Sep-2003; LatestRevisionDate: 12-Dec-2006; LatestRevisionNote: IPC-7351 Footprint Added.; DatasheetVersion: 4-Mar-2002; PackageVersion: May-1999; PackageReference: SOT23; Publisher: Altium Limited; PackageDescription: 3-Pin SOT-23 Package 0.95 mm Pitch, 2.3 mm Lead Span; ComponentLink1Description: Manufacturer Link; ComponentLink1URL: http://www.semiconductors.philips.com/; ComponentLink2Description: Datasheet; ComponentLink2URL: http://www.semiconductors.philips.com/acrobat/datasheets/BAT54_SERIES_4.pdf
D8-D17 = BAV99: Silicon Switching Diode Array for High-Speed Switching; Published: 21-Mar-2003; DatasheetDocument: Oct-1999; PackageDocument: Sep-2001; PackageReference: SOT-23; Publisher: Altium Limited; ComponentLink1Description: Manufacturer Link; ComponentLink1URL: http://www.infineon.com/; ComponentLink2Description: Datasheet; ComponentLink2URL: http://www.infineon.com/upload/Document/cmc_upload/documents/080/631/bav99series_1.pdf
FB1 = Inductor Isolated: Isolated Inductor; PackageDocument: 1988; Published: 24-Mar-1999; LatestRevisionDate: 17-Jul-2002; LatestRevisionNote: Re-released for DXP Platform.; PackageReference: 425; Publisher: Altium Limited
J3 J5 = TS8P8C-PCB-UH: Description: Cvilux - CJ3188A1100; Supplier: Comet; Value: TS8P8C-PCB-UH
J4 = Micro SD Socket PP T1: Manufacturer: Attend Technology; Supplier: Comet; Order Code: Micro SD Socket PP T1
L1-L14 = CCFH0805 coil Coils: SRF: Self resonance frequency = 375MHz; Supplier: Comet; Datasheet: http://home.comet.bg/datasheets/Coils/CCFH0805 C Series.pdf; Price: 0.10 Euro
LED1 = 515-1061F_2x dual LED's: as LED1 on sheet GPS supply2; Light pipe: 515-1061F
Pp = Header 6: Header, 6-Pin; LatestRevisionDate: 17-Jul-2002; LatestRevisionNote: Re-released for DXP Platform.; Publisher: Altium Limited
Q1-Q3 Q8 = BSS138_my
Q9 = BSS84_my: Manufacturer: Zetex; Rohm, etc; PackageDescription: SOT-23; 3 Leads; Body 3.1 x 2.5 mm, inc. leads (LxW max), Alternate Lead Configuration
R5 R6 R8 R12-R14 R16 R18 R19 R21 R33-R46 R48 R49 = Res2: Resistor; Published: 8-Jun-2000; LatestRevisionDate: 17-Jul-2002; LatestRevisionNote: Re-released for DXP Platform.; PackageReference: AXIAL-0.4; Publisher: Altium Limited
Sw1 = PCM12SMTR: Ultraminiature Surface Mount Slide Switch; Manufacturer: C & K COMPONENTS; Max Voltage: 6V @ 0.3A; Order Code: 9575146; Series: C&K PCM Series; Switch configuration: SPDT; Supplier: Farnell; Price: 1.24 ˆ
U1 = L70 Quectel: Chipset: MT3339
U2 = PIC24FJ128GA106-I/PT: General Purpose 16-Bit Flash Microcontroller, 128KB Flash, 16KB SRAM, 64-Pin TQFP, Industrial Temperature; FirstPublished: 29-Jan-2009; LatestRevisionDate: 02-Dec-2009; LatestRevisionNote: Updated schematic according to current datasheet revision.; DatasheetVersion: revC, Apr-2009; PackageVersion: revBB, Aug-2009; PackageReference: TQFP-PT64; Publisher: Altium Limited; PackageDescription: 64-Lead Thin Plastic Quad Flat Pack (PT) - 10x10x1mm Body, 2.00mm [TQFP]; Supplier 1: Digi-Key; Supplier Part Number 1: PIC24FJ128GA106-I/PT-ND; Supplier 2: Farnell; Supplier Part Number 2: 1576845; Supplier 3: Newark; Supplier Part Number 3: 54M5089; Code_JEDEC: MS-026; ComponentLink1Description: Datasheet; ComponentLink1URL: http://ww1.microchip.com/downloads/en/DeviceDoc/39905c.pdf; ComponentLink2Description: Packaging Specification; ComponentLink2URL: http://www.microchip.com/stellent/groups/techpub_sg/documents/packagingspec/en012702.pdf; ComponentLink3Description: Microchip.com Home; ComponentLink3URL: http://www.microchip.com/
U3 = FPF2116: Load Switch, current limited, status output; Manufacturer: Fairchild Semiconductor; Description: IntelliMAX™ Advanced Load Management Switch; Voltage range: 1.8V to 5.5V Input; Over current limit: 200mA typical; On input: active high => switch is on; Order Code: 1716991; Supplier: Farnell; Price: ˆ0.53
U4 = MCP9700AT-E/TT: Low-Power Linear Active Thermistor IC, 3-Pin SOT-23, Extended Temperature, Tape and Reel; FirstPublished: 29-Jan-2009; LatestRevisionDate: 02-Dec-2009; LatestRevisionNote: Updated datasheet to version revE, Apr-2009.; DatasheetVersion: revE, Apr-2009; PackageVersion: revBB, Aug-2009; PackageReference: SOT-23-TT3; Publisher: Altium Limited; PackageDescription: 3-Lead Plastic Small Outline Transistor (TT) [SOT-23]; Supplier 1: Digi-Key; Supplier Part Number 1: MCP9700AT-E/TTTR-ND; Supplier 2: Farnell; Supplier Part Number 2: 1605577; Supplier 3: Newark; Supplier Part Number 3: 17M0677; Code_IPC: SOT23-3; ComponentLink1Description: Datasheet; ComponentLink1URL: http://ww1.microchip.com/downloads/en/DeviceDoc/21942e.pdf; ComponentLink2Description: Packaging Specification; ComponentLink2URL: http://www.microchip.com/stellent/groups/techpub_sg/documents/packagingspec/en012702.pdf; ComponentLink3Description: Microchip.com Home; ComponentLink3URL: http://www.microchip.com/
C8 = Cap Semi: Published: 8-Jun-2000; LatestRevisionDate: 17-Jul-2002; LatestRevisionNote: Re-released for DXP Platform.; Publisher: Altium Limited
J2 = SMA R/A PCB: Created by: Charge

## Sheet Tracker RS232_2.SchDoc: GPS Tracker APRS based
size A4; DrawnBy: I. Ivanov; Engineer: Eng. I. Ivanov; SheetNumber: 3; SheetTotal: 3; ProjectName: GPS Tracker APRS based
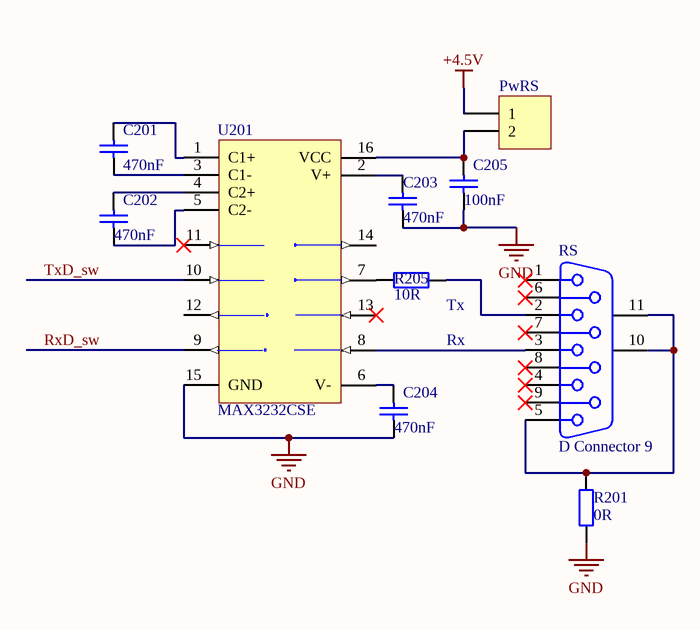
[diagram p3: Tracker RS232_2.SchDoc]

### Parts
C201  value 470nF  [2012[0805]]  (hidden comment: Cap Semi)
C202  value 470nF  [2012[0805]]  (hidden comment: Cap Semi)
C203  value 470nF  [2012[0805]]  (hidden comment: Cap Semi)
C204  value 470nF  [2012[0805]]  (hidden comment: Cap Semi)
C205  value 100nF  [2012[0805]]  (hidden comment: Cap Semi)
PwRS  Header 2  [HDR1X2]  (value not drawn)
R201  value 0R  [3216[1206]]  (hidden comment: Res2)
R205  value 10R  [2012[0805]]  (hidden comment: Res2)
RS  D Connector 9  [DSUB1.385-2H9]
U201  MAX3232CSE  [NSO16_N]

### Nets
+4.5V: PwRS.1
GND: C203.1 C204.1 C205.1 R201.2 U201.15(GND)
RxD_sw: U201.9(R2OUT)
TxD_sw: U201.10(T2IN)
NetC201_1: C201.1 U201.3(C1-)
NetC201_2: C201.2 U201.1(C1+)
NetC202_1: C202.1 U201.5(C2-)
NetC202_2: C202.2 U201.4(C2+)
NetC203_2: C203.2 U201.2(V+)
NetC204_2: C204.2 U201.6(V-)
NetC205_2: C205.2 PwRS.2 U201.16(VCC)
NetR201_1: R201.1 RS.5 RS.10(MH1) RS.11(MH2)
NetR205_1: R205.1 U201.7(T2OUT)
NetR205_2: R205.2 RS.2
NetRS_3: RS.3 U201.8(R2IN)

Not connected (* = marked no-connect by the designer): RS 1* 4* 6* 7* 8* 9*; U201 11(T1IN)* 12(R1OUT) 13(R1IN)* 14(T1OUT)

### Notes on the sheet
- (near R205) Tx
- Rx

### Library data of the parts
C201-C205 = Cap Semi: Capacitor (Semiconductor SIM Model); Published: 8-Jun-2000; LatestRevisionDate: 17-Jul-2002; LatestRevisionNote: Re-released for DXP Platform.; PackageReference: C1206; Publisher: Altium Limited
PwRS = Header 2: Header, 2-Pin; LatestRevisionDate: 17-Jul-2002; LatestRevisionNote: Re-released for DXP Platform.; Publisher: Altium Limited
R201 R205 = Res2: Resistor; Published: 8-Jun-2000; LatestRevisionDate: 17-Jul-2002; LatestRevisionNote: Re-released for DXP Platform.; PackageReference: AXIAL-0.4; Publisher: Altium Limited
RS = D Connector 9: Receptacle Assembly, 9 Position, Right Angle; PackageDocument: O; Positions: 9; Published: 15-Jun-2001; LatestRevisionDate: 17-Jul-2002; LatestRevisionNote: Re-released for DXP Platform.; DatasheetDocument: 1-Sep-1999; PackageReference: 788750; Publisher: Altium Limited; Orientation: Right Angle; Gender: Receptacle
U201 = MAX3232CSE: 3.0V TO 5.5V, Low-Power, up to 1Mbps, True RS-232 Transceiver Using Four 0.1µF External Capacitor; Published: 16-Jan-2001; LatestRevisionDate: 13-Apr-2006; LatestRevisionNote: IPC-7351 Footprint Added.; DatasheetVersion: Mar-1999; PackageReference: NSO16; Publisher: Altium Limited; PackageDescription: 16-Pin Small Outline Integrated Circuit 1.27 mm Pitch; Code_JEDEC: MS-012-AC; Code_IPC: SOIC127P600-16; ComponentLink1Description: Manufacturer Link; ComponentLink1URL: http://www.maxim-ic.com/; ComponentLink2Description: Datasheet; ComponentLink2URL: http://pdfserv.maxim-ic.com/en/ds/MAX3222-MAX3241.pdf

## Nets that join several sheets
+3V3: GPS supply2 (14 pins), GPS track2 (36 pins)
+3V3Ana: GPS supply2 (C132.2 FB2.1), GPS track2 (C35.2 C41.1 U2.19 U4.1)
+4.5V: GPS supply2 (12 pins), Tracker RS232_2 (PwRS.1)
+13V_ext: GPS supply2 (5 pins), GPS track2 (R43.1)
GND: GPS supply2 (40 pins), GPS track2 (66 pins), Tracker RS232_2 (5 pins)
1_Wire: GPS supply2 (R129.2 R131.1), GPS track2 (U2.3)
RxD_sw: GPS track2 (U2.45), Tracker RS232_2 (U201.9)
TxD_sw: GPS track2 (U2.46), Tracker RS232_2 (U201.10)